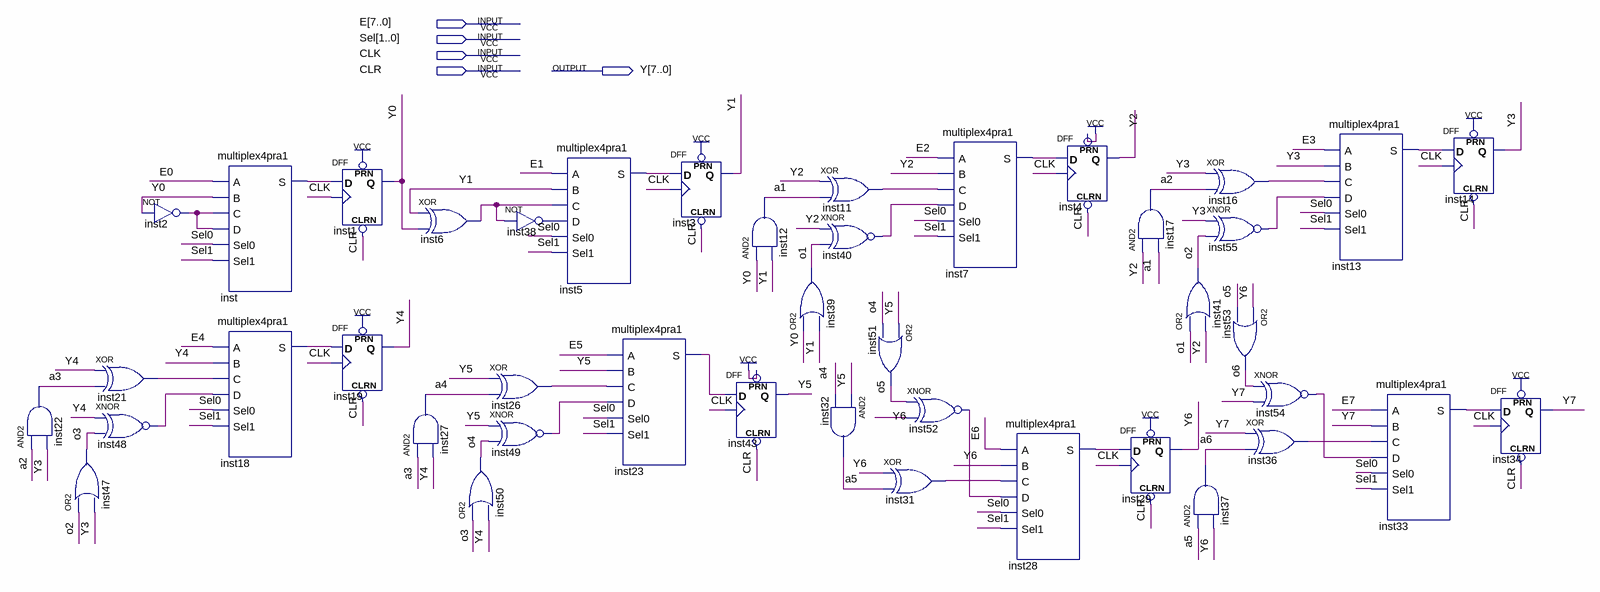
[diagram p0: schematic sheet]
// Quartus schematic RegistradorContador.bdf as structural Verilog: 43 symbols, 5 pins
module RegistradorContador (
  input  [7:0] E,
  input  [1:0] Sel,
  input  CLK,
  input  CLR,
  output [7:0] Y
);

  wire a1, a2, a3, a4, a5, a6, inst2_out, inst5_s, inst6_out, inst7_s, inst11_out, inst13_s, inst16_out,
       inst18_s, inst21_out, inst23_s, inst26_out, inst28_s, inst31_out, inst33_s, inst36_out, inst38_out,
       inst40_out, inst48_out, inst49_out, inst52_out, inst54_out, inst55_out, inst_s, o1, o2, o3, o4, o5, o6;

  and inst22 (a3, a2, Y[3]);
  xor inst21 (inst21_out, Y[4], a3);
  xnor inst48 (inst48_out, Y[4], o3);
  or inst47 (o3, o2, Y[3]);
  not inst2 (inst2_out, Y[0]);
  multiplex4pra1 inst (.A(E[0]), .B(Y[0]), .C(inst2_out), .D(inst2_out), .Sel0(Sel[0]), .Sel1(Sel[1]), .S(inst_s));
  multiplex4pra1 inst18 (
    .A(E[4]), .B(Y[4]), .C(inst21_out), .D(inst48_out), .Sel0(Sel[0]), .Sel1(Sel[1]), .S(inst18_s));
  DFF inst1 (.CLRN(CLR), .CLK(CLK), .D(inst_s), .PRN(1'b1), .Q(Y[0]));
  DFF inst19 (.CLRN(CLR), .CLK(CLK), .D(inst18_s), .PRN(1'b1), .Q(Y[4]));
  and inst27 (a4, a3, Y[4]);
  xor inst6 (inst6_out, Y[1], Y[0]);
  or inst50 (o4, o3, Y[4]);
  not inst38 (inst38_out, inst6_out);
  xor inst26 (inst26_out, Y[5], a4);
  xnor inst49 (inst49_out, Y[5], o4);
  multiplex4pra1 inst5 (.A(E[1]), .B(Y[1]), .C(inst6_out), .D(inst38_out), .Sel0(Sel[0]), .Sel1(Sel[1]), .S(inst5_s));
  multiplex4pra1 inst23 (
    .A(E[5]), .B(Y[5]), .C(inst26_out), .D(inst49_out), .Sel0(Sel[0]), .Sel1(Sel[1]), .S(inst23_s));
  DFF inst3 (.CLRN(CLR), .CLK(CLK), .D(inst5_s), .PRN(1'b1), .Q(Y[1]));
  DFF inst43 (.CLRN(CLR), .CLK(CLK), .D(inst23_s), .PRN(1'b1), .Q(Y[5]));
  and inst12 (a1, Y[0], Y[1]);
  or inst39 (o1, Y[0], Y[1]);
  xor inst11 (inst11_out, Y[2], a1);
  xnor inst40 (inst40_out, Y[2], o1);
  and inst32 (a5, Y[5], a4);
  or inst51 (o5, Y[5], o4);
  xnor inst52 (inst52_out, o5, Y[6]);
  xor inst31 (inst31_out, Y[6], a5);
  multiplex4pra1 inst7 (.A(E[2]), .B(Y[2]), .C(inst11_out), .D(inst40_out), .Sel0(Sel[0]), .Sel1(Sel[1]), .S(inst7_s));
  multiplex4pra1 inst28 (
    .A(E[6]), .B(Y[6]), .C(inst31_out), .D(inst52_out), .Sel0(Sel[0]), .Sel1(Sel[1]), .S(inst28_s));
  DFF inst4 (.CLRN(CLR), .CLK(CLK), .D(inst7_s), .PRN(1'b1), .Q(Y[2]));
  and inst17 (a2, Y[2], a1);
  DFF inst29 (.CLRN(CLR), .CLK(CLK), .D(inst28_s), .PRN(1'b1), .Q(Y[6]));
  xor inst16 (inst16_out, Y[3], a2);
  xnor inst55 (inst55_out, Y[3], o2);
  or inst41 (o2, o1, Y[2]);
  or inst53 (o6, Y[6], o5);
  and inst37 (a6, a5, Y[6]);
  xnor inst54 (inst54_out, o6, Y[7]);
  xor inst36 (inst36_out, Y[7], a6);
  multiplex4pra1 inst13 (
    .A(E[3]), .B(Y[3]), .C(inst16_out), .D(inst55_out), .Sel0(Sel[0]), .Sel1(Sel[1]), .S(inst13_s));
  multiplex4pra1 inst33 (
    .A(E[7]), .B(Y[7]), .C(inst36_out), .D(inst54_out), .Sel0(Sel[0]), .Sel1(Sel[1]), .S(inst33_s));
  DFF inst14 (.CLRN(CLR), .CLK(CLK), .D(inst13_s), .PRN(1'b1), .Q(Y[3]));
  DFF inst34 (.CLRN(CLR), .CLK(CLK), .D(inst33_s), .PRN(1'b1), .Q(Y[7]));
endmodule
